# Altium project MAX_V5.PrjPcb
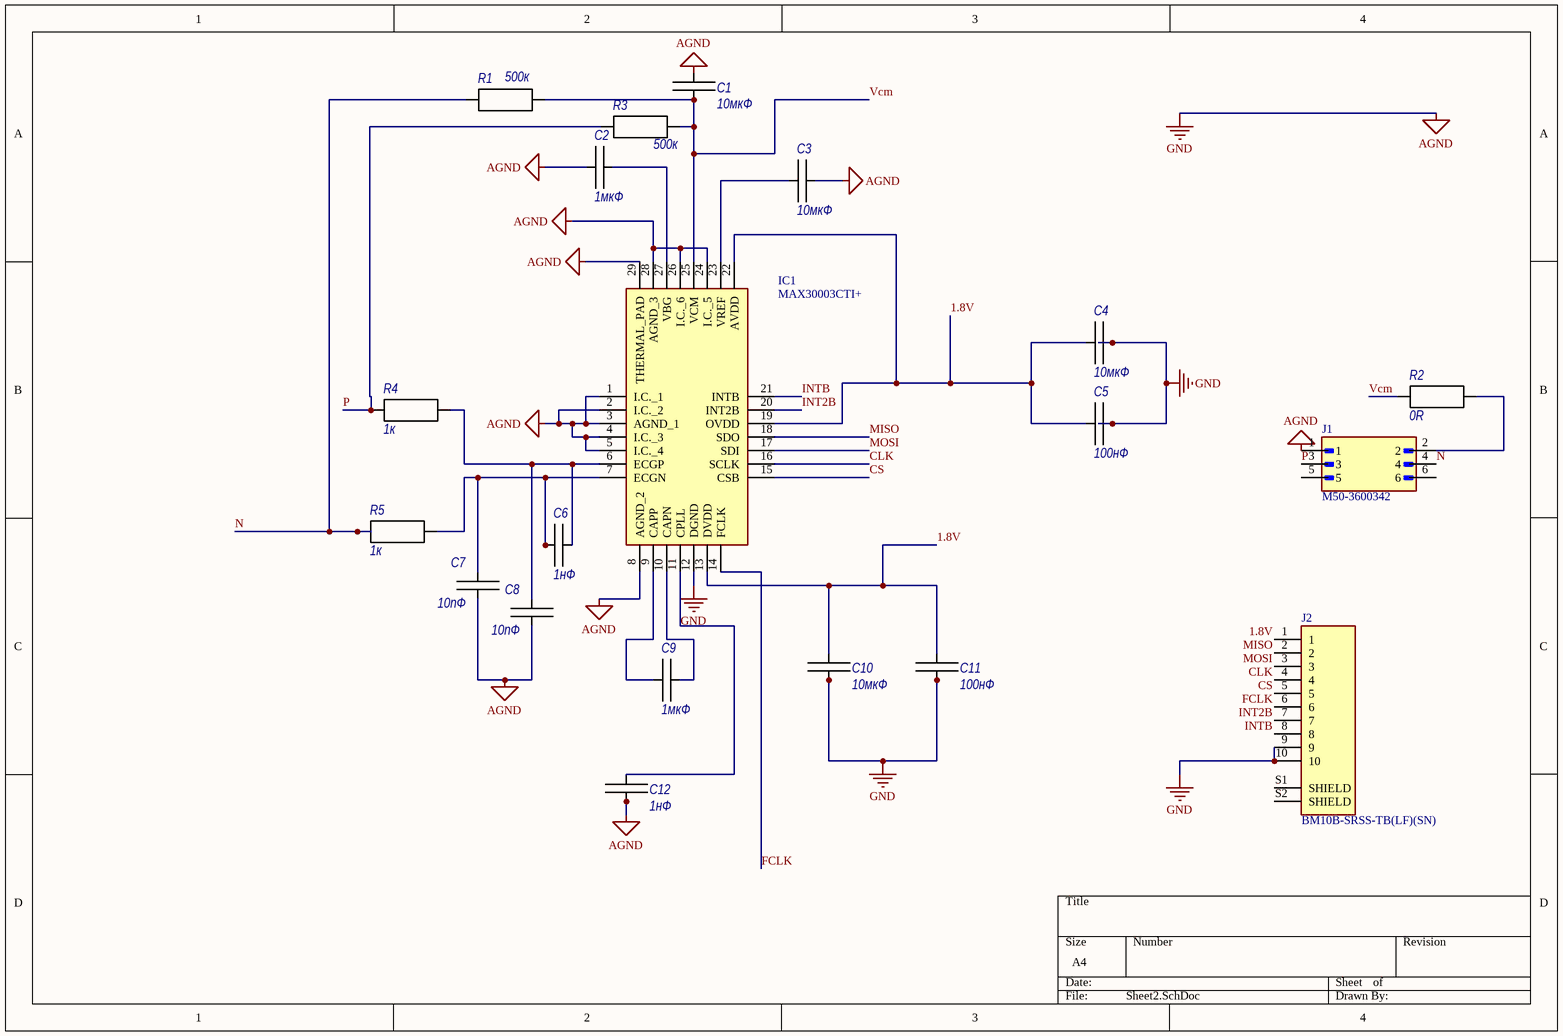
[diagram p0: Sheet2.SchDoc]
1 sheet, 20 parts. Net scope: global (net labels, ports and power ports of the same name join across sheets).
Board file: PCB2.PcbDoc

## Sheet Sheet2.SchDoc
size A4; SheetNumber: 1; SheetTotal: 1

### Parts
C1  10мкФ  [C0402C]
C2  1мкФ  [C0402C]
C3  10мкФ  [C0402C]
C4  10мкФ  [C0402C]
C5  100нФ  [C0402C]
C6  1нФ  [C0402C]
C7  10пФ  [C0402C]
C8  10пФ  [C0402C]
C9  1мкФ  [C0402C]
C10  10мкФ  [C0402C]
C11  100нФ  [C0402C]
C12  1нФ  [C0402C]
IC1  MAX30003CTI+  [QFN50P500X500X80-29N]
J1  M50-3600342  [HARWIN_M50-3600342]
J2  BM10B-SRSS-TB(LF)(SN)  [JST_BM10B-SRSS-TB(LF)(SN)]
R1  500к  [C0402R]
R2  0R  [C0402R]
R3  500к  [C0402R]
R4  1к  [C0402R]
R5  1к  [C0402R]

### Nets
AGND: C1.2 C2.2 C3.2 C4.2 C5.2 C7.1 C8.1 C10.2 C11.2 C12.2 IC1.1(I.C._1) IC1.2(I.C._2) IC1.3(AGND_1) IC1.4(I.C._3) IC1.5(I.C._4) IC1.8(AGND_2) IC1.12(DGND) IC1.24(I.C._5) IC1.26(I.C._6) IC1.28(AGND_3) IC1.29(THERMAL_PAD) J1.1 J2.9 J2.10  [also labelled GND]
1.8V: C4.1 C5.1 C10.1 C11.1 IC1.13(DVDD) IC1.19(OVDD) IC1.22(AVDD) J2.1
CLK: IC1.16(SCLK) J2.4
CS: IC1.15(CSB) J2.5
FCLK: IC1.14(FCLK) J2.6
INT2B: IC1.20(INT2B) J2.7
INTB: IC1.21(INTB) J2.8
MISO: IC1.18(SDO) J2.2
MOSI: IC1.17(SDI) J2.3
N: J1.4 R1.2 R5.2
P: J1.3 R3.2 R4.2
Vcm: C1.1 IC1.25(VCM) R1.1 R2.2 R3.1
NetC2_1: C2.1 IC1.27(VBG)
NetC3_1: C3.1 IC1.23(VREF)
NetC6_1: C6.1 C8.2 IC1.6(ECGP) R4.1
NetC6_2: C6.2 C7.2 IC1.7(ECGN) R5.1
NetC9_1: C9.1 IC1.10(CAPN)
NetC9_2: C9.2 IC1.9(CAPP)
NetC12_1: C12.1 IC1.11(CPLL)
NetJ1_2: J1.2 R2.1

Not connected (* = marked no-connect by the designer): J1 5 6; J2 S1(SHIELD) S2(SHIELD)

### Library data of the parts
C1-C12 = CC0402JRX7R9BB103: CC0402JRX7R9BB103, 0402 X5R 0,01 uF 50V; Manufacturer: Yageo; Value: 0,01; Tolerance: ±10%; Tmin: -55; Tmax: 125; Component Note: 0402 0,01uF ±10% 50V X5R; Part Number: CC0402JRX7R9BB103; Package: SMD 0402; Units: uF; Dielectric: X5R; Voltage: 50V; ComponentLink1Description: Datasheet
IC1 = MAX30003CTI+: Integrated Circuit; Manufacturer_Name: Analog Devices; Datasheet Link: https://datasheets.maximintegrated.com/en/ds/MAX30003.pdf; Height: 0.8mm; Manufacturer_Part_Number: MAX30003CTI+; Mouser Part Number: 700-MAX30003CTI+; Mouser Price/Stock: https://www.mouser.co.uk/ProductDetail/Analog-Devices-Maxim-Integrated/MAX30003CTI%2b?qs=rUyhvjvpWj%2FiU0gYUPHOFw%3D%3D; Arrow Part Number: MAX30003CTI+; Arrow Price/Stock: https://www.arrow.com/en/products/max30003cti/maxim-integrated?region=nac
J2 = BM10B-SRSS-TB(LF)(SN): Connector Header Surface Mount 10 position 0.039 (1.00mm); MF: JST Sales; MP: BM10B-SRSS-TB(LF)(SN); Package: None; Check_prices: https://www.snapeda.com/parts/BM10B-SRSS-TB(LF)(SN)/JST+Sales+America+Inc./view-part/?ref=eda; SnapEDA_Link: https://www.snapeda.com/parts/BM10B-SRSS-TB(LF)(SN)/JST+Sales+America+Inc./view-part/?ref=snap; Availability: In Stock; Price: None; Value: *
R1 R3-R5 = Р1-12М-0402-0: Р1-12М-0402-0,  SMD 0402; Manufacturer: НПО ЭРКОН; Value: 0R; Component Note: 0402 0R; TU: АБШК.434110.023 ТУ; Part Number: Р1-12М-0402-0; Package: SMD 0402; Type: Р1-12М
R2 = Р1-12М-0402-0: Р1-12М-0402-0,  SMD 0402; Manufacturer: НПО ЭРКОН; Component Note: 0402 0R; TU: АБШК.434110.023 ТУ; Part Number: Р1-12М-0402-0; Package: SMD 0402; Type: Р1-12М; Value: 0R
J1 = M50-3600342: Package: None; Price: None; Value: *; MP: M50-3600342; Availability: Unavailable